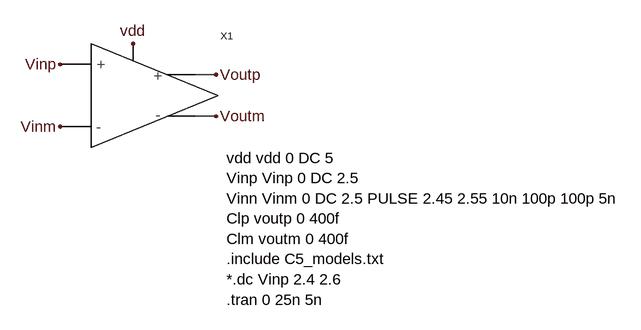
[diagram p0: schematic _Fig9_29_MSD.asc]
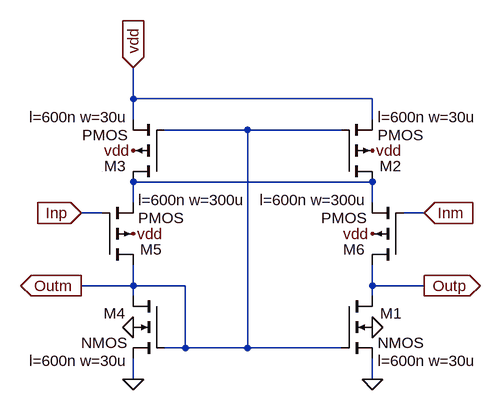
[diagram p1: sub-circuit amp.asc]
_Fig9_29_MSD.asc, the LTspice schematic file:
Version 4
SHEET 1 924 680
WIRE 208 0 176 0
WIRE 208 64 176 64
FLAG 80 -48 vdd
FLAG -32 -16 Vinp
FLAG -32 80 Vinm
FLAG 208 0 Voutp
FLAG 208 64 Voutm
SYMBOL amp 16 32 R0
SYMATTR InstName X1
TEXT 224 128 Left 2 !vdd vdd 0 DC 5\nVinp Vinp 0 DC 2.5\nVinn Vinm 0 DC 2.5 PULSE 2.45 2.55 10n 100p 100p 5n\nClp voutp 0 400f\nClm voutm 0 400f\n.include C5_models.txt\n*.dc Vinp 2.4 2.6\n.tran 0 25n 5n

amp.asc, the sub-circuit schematic file:
Version 4
SHEET 1 880 680
WIRE 48 -112 48 -160
WIRE 416 -112 48 -112
WIRE 48 -80 48 -112
WIRE 416 -80 416 -112
WIRE 224 -64 96 -64
WIRE 368 -64 224 -64
WIRE 416 16 48 16
WIRE 48 48 48 16
WIRE 416 48 416 16
WIRE 0 64 -32 64
WIRE 496 64 464 64
WIRE 48 176 48 144
WIRE 48 176 -32 176
WIRE 128 176 48 176
WIRE 416 176 416 144
WIRE 496 176 416 176
WIRE 48 192 48 176
WIRE 416 192 416 176
WIRE 128 272 128 176
WIRE 128 272 96 272
WIRE 224 272 224 -64
WIRE 224 272 128 272
WIRE 368 272 224 272
WIRE 48 320 48 288
WIRE 416 320 416 288
WIRE 0 0 0 0
FLAG 416 320 0
FLAG 416 240 0
FLAG -32 64 Inp
IOPIN -32 64 In
FLAG 416 -32 vdd
FLAG 496 176 Outp
IOPIN 496 176 Out
FLAG 48 -160 vdd
IOPIN 48 -160 In
FLAG 48 -32 vdd
FLAG 48 320 0
FLAG 48 240 0
FLAG 48 96 vdd
FLAG 416 96 vdd
FLAG 496 64 Inm
IOPIN 496 64 In
FLAG -32 176 Outm
IOPIN -32 176 Out
SYMBOL nmos4 368 192 R0
WINDOW 123 56 100 Left 2
WINDOW 0 60 27 Left 2
SYMATTR Value2 l=600n w=30u
SYMATTR InstName M1
SYMBOL pmos4 368 16 M180
WINDOW 123 56 100 Left 2
WINDOW 0 59 24 Left 2
SYMATTR Value2 l=600n w=30u
SYMATTR InstName M2
SYMBOL pmos4 96 16 R180
WINDOW 123 56 100 Left 2
WINDOW 0 59 24 Left 2
SYMATTR Value2 l=600n w=30u
SYMATTR InstName M3
SYMBOL nmos4 96 192 M0
WINDOW 123 56 100 Left 2
WINDOW 0 60 27 Left 2
SYMATTR Value2 l=600n w=30u
SYMATTR InstName M4
SYMBOL pmos4 0 144 M180
WINDOW 123 56 100 Left 2
WINDOW 0 59 24 Left 2
SYMATTR Value2 l=600n w=300u
SYMATTR InstName M5
SYMBOL pmos4 464 144 R180
WINDOW 123 56 100 Left 2
WINDOW 0 59 24 Left 2
SYMATTR Value2 l=600n w=300u
SYMATTR InstName M6

The netlist it stands for:
* _Fig9_29_MSD.asc
XX1 Vinp Vinm Voutp Voutm vdd amp

* block symbol definitions
.subckt amp Inp Inm Outp Outm vdd
M1 Outp Outm 0 0 NMOS l=600n w=30u
M2 N001 Outm vdd vdd PMOS l=600n w=30u
M3 N001 Outm vdd vdd PMOS l=600n w=30u
M4 Outm Outm 0 0 NMOS l=600n w=30u
M5 Outm Inp N001 vdd PMOS l=600n w=300u
M6 Outp Inm N001 vdd PMOS l=600n w=300u
.ends amp

.model NMOS NMOS
.model PMOS PMOS
.lib standard.mos
vdd vdd 0 DC 5
Vinp Vinp 0 DC 2.5
Vinn Vinm 0 DC 2.5 PULSE 2.45 2.55 10n 100p 100p 5n
Clp voutp 0 400f
Clm voutm 0 400f
.include C5_models.txt
*.dc Vinp 2.4 2.6
.tran 0 25n 5n
.backanno
.end